# Altium schematic sheet 2-CPU_POWER.SchDoc
size C
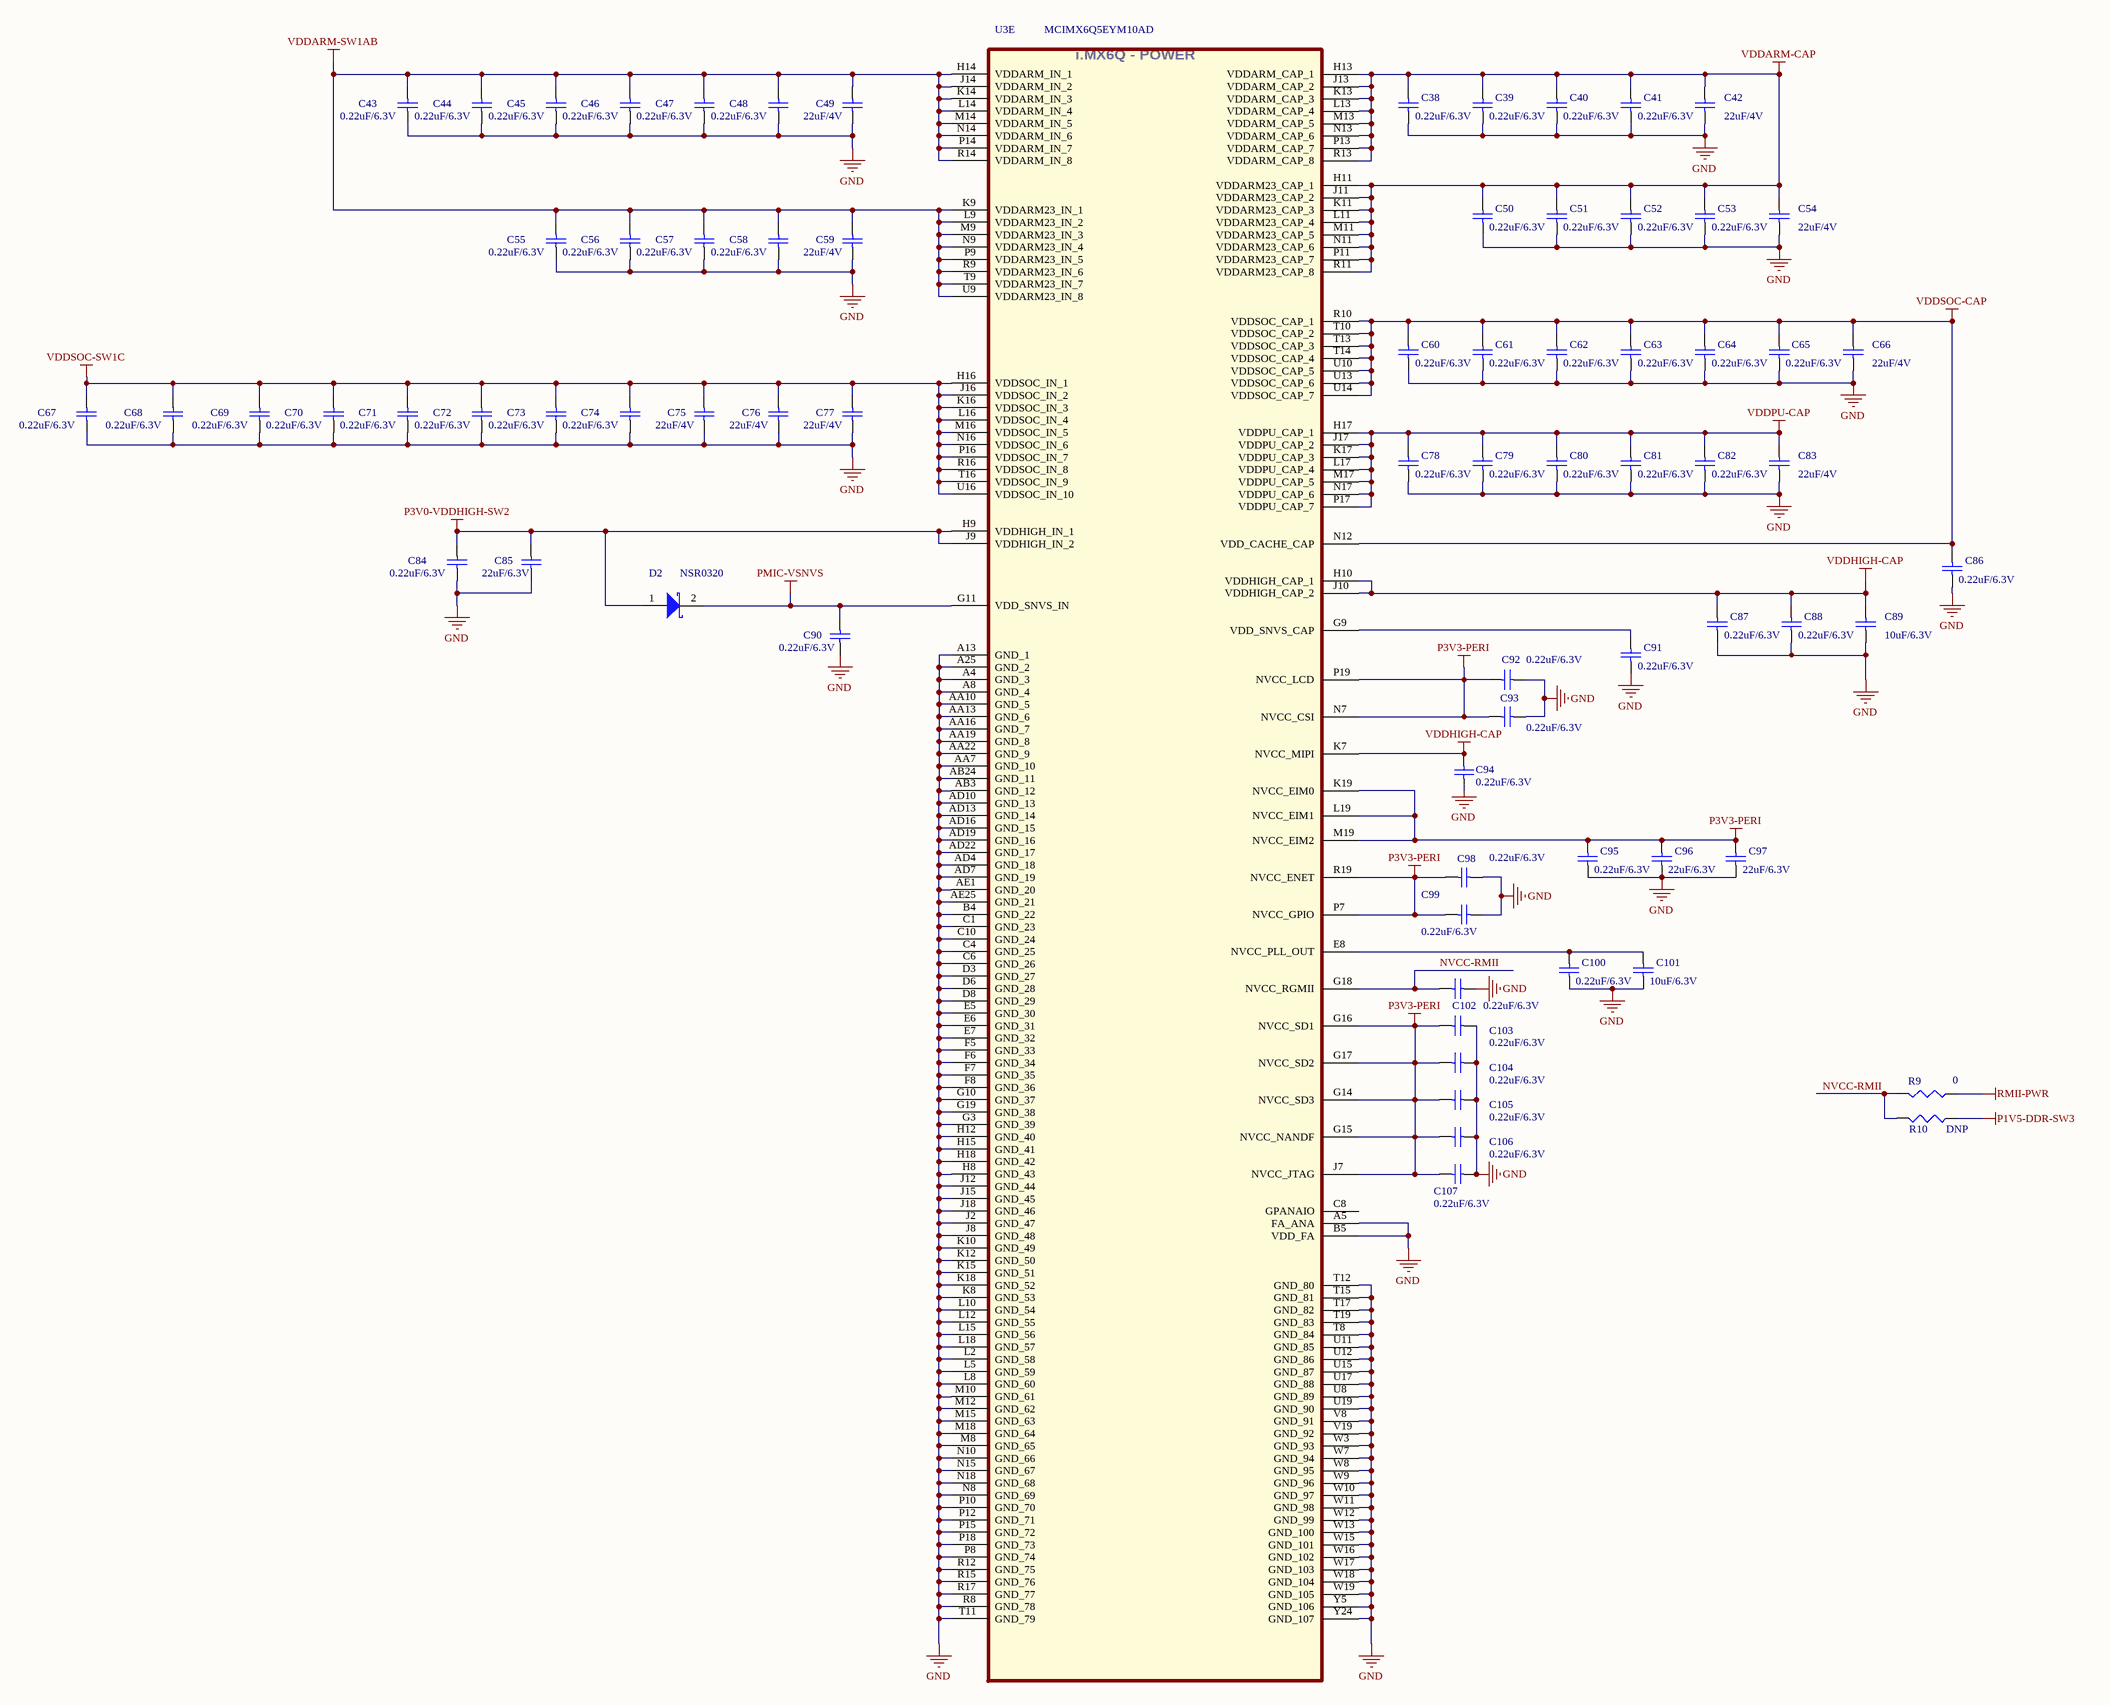
[diagram p0: 2-CPU_POWER.SchDoc]

## Parts
C38  0.22uF/6.3V  [0201_CC]
C39  0.22uF/6.3V  [0201_CC]
C40  0.22uF/6.3V  [0201_CC]
C41  0.22uF/6.3V  [0201_CC]
C42  22uF/4V  [0603_CC]
C43  0.22uF/6.3V  [0201_CC]
C44  0.22uF/6.3V  [0201_CC]
C45  0.22uF/6.3V  [0201_CC]
C46  0.22uF/6.3V  [0201_CC]
C47  0.22uF/6.3V  [0201_CC]
C48  0.22uF/6.3V  [0201_CC]
C49  22uF/4V  [0603_CC]
C50  0.22uF/6.3V  [0201_CC]
C51  0.22uF/6.3V  [0201_CC]
C52  0.22uF/6.3V  [0201_CC]
C53  0.22uF/6.3V  [0201_CC]
C54  22uF/4V  [0603_CC]
C55  0.22uF/6.3V  [0201_CC]
C56  0.22uF/6.3V  [0201_CC]
C57  0.22uF/6.3V  [0201_CC]
C58  0.22uF/6.3V  [0201_CC]
C59  22uF/4V  [0603_CC]
C60  0.22uF/6.3V  [0201_CC]
C61  0.22uF/6.3V  [0201_CC]
C62  0.22uF/6.3V  [0201_CC]
C63  0.22uF/6.3V  [0201_CC]
C64  0.22uF/6.3V  [0201_CC]
C65  0.22uF/6.3V  [0201_CC]
C66  22uF/4V  [0603_CC]
C67  0.22uF/6.3V  [0201_CC]
C68  0.22uF/6.3V  [0201_CC]
C69  0.22uF/6.3V  [0201_CC]
C70  0.22uF/6.3V  [0201_CC]
C71  0.22uF/6.3V  [0201_CC]
C72  0.22uF/6.3V  [0201_CC]
C73  0.22uF/6.3V  [0201_CC]
C74  0.22uF/6.3V  [0201_CC]
C75  22uF/4V  [0603_CC]
C76  22uF/4V  [0603_CC]
C77  22uF/4V  [0603_CC]
C78  0.22uF/6.3V  [0201_CC]
C79  0.22uF/6.3V  [0201_CC]
C80  0.22uF/6.3V  [0201_CC]
C81  0.22uF/6.3V  [0201_CC]
C82  0.22uF/6.3V  [0201_CC]
C83  22uF/4V  [0603_CC]
C84  0.22uF/6.3V  [0201_CC]
C85  22uF/6.3V  [0805_CC]
C86  0.22uF/6.3V  [0201_CC]
C87  0.22uF/6.3V  [0201_CC]
C88  0.22uF/6.3V  [0201_CC]
C89  10uF/6.3V  [0805_CC]
C90  0.22uF/6.3V  [0201_CC]
C91  0.22uF/6.3V  [0201_CC]
C92  0.22uF/6.3V  [0201_CC]
C93  0.22uF/6.3V  [0201_CC]
C94  0.22uF/6.3V  [0201_CC]
C95  0.22uF/6.3V  [0201_CC]
C96  22uF/6.3V  [0805_CC]
C97  22uF/6.3V  [0805_CC]
C98  0.22uF/6.3V  [0201_CC]
C99  0.22uF/6.3V  [0201_CC]
C100  0.22uF/6.3V  [0201_CC]
C101  10uF/6.3V  [0805_CC]
C102  0.22uF/6.3V  [0201_CC]
C103  0.22uF/6.3V  [0201_CC]
C104  0.22uF/6.3V  [0201_CC]
C105  0.22uF/6.3V  [0201_CC]
C106  0.22uF/6.3V  [0201_CC]
C107  0.22uF/6.3V  [0201_CC]
D2  NSR0320  [SOD323]
R9  0  [0603_CC]
R10  DNP  [0603_CC]
U3  MCIMX6Q5EYM10AD  [FCPBGA]  (part E of 12)

## Nets
GND: C38.2 C39.2 C40.2 C41.2 C42.2 C43.2 C44.2 C45.2 C46.2 C47.2 C48.2 C49.2 C50.2 C51.2 C52.2 C53.2 C54.2 C55.2 C56.2 C57.2 C58.2 C59.2 C60.2 C61.2 C62.2 C63.2 C64.2 C65.2 C66.2 C67.2 C68.2 C69.2 C70.2 C71.2 C72.2 C73.2 C74.2 C75.2 C76.2 C77.2 C78.2 C79.2 C80.2 C81.2 C82.2 C83.2 C84.2 C85.2 C86.2 C87.2 C88.2 C89.2 C90.2 C91.2 C92.2 C93.2 C94.1 C95.2 C96.2 C97.2 C98.2 C99.2 C100.2 C101.2 C102.2 C103.2 C104.2 C105.2 C106.2 C107.2 U3.A4(GND_3) U3.A5(FA_ANA) U3.A8(GND_4) U3.A13(GND_1) U3.A25(GND_2) U3.AA7(GND_10) U3.AA10(GND_5) U3.AA13(GND_6) U3.AA16(GND_7) U3.AA19(GND_8) U3.AA22(GND_9) U3.AB3(GND_12) U3.AB24(GND_11) U3.AD4(GND_18) U3.AD7(GND_19) U3.AD10(GND_13) U3.AD13(GND_14) U3.AD16(GND_15) U3.AD19(GND_16) U3.AD22(GND_17) U3.AE1(GND_20) U3.AE25(GND_21) U3.B4(GND_22) U3.B5(VDD_FA) U3.C1(GND_23) U3.C4(GND_25) U3.C6(GND_26) U3.C10(GND_24) U3.D3(GND_27) U3.D6(GND_28) U3.D8(GND_29) U3.E5(GND_30) U3.E6(GND_31) U3.E7(GND_32) U3.F5(GND_33) U3.F6(GND_34) U3.F7(GND_35) U3.F8(GND_36) U3.G3(GND_39) U3.G10(GND_37) U3.G19(GND_38) U3.H8(GND_43) U3.H12(GND_40) U3.H15(GND_41) U3.H18(GND_42) U3.J2(GND_47) U3.J8(GND_48) U3.J12(GND_44) U3.J15(GND_45) U3.J18(GND_46) U3.K8(GND_53) U3.K10(GND_49) U3.K12(GND_50) U3.K15(GND_51) U3.K18(GND_52) U3.L2(GND_58) U3.L5(GND_59) U3.L8(GND_60) U3.L10(GND_54) U3.L12(GND_55) U3.L15(GND_56) U3.L18(GND_57) U3.M8(GND_65) U3.M10(GND_61) U3.M12(GND_62) U3.M15(GND_63) U3.M18(GND_64) U3.N8(GND_69) U3.N10(GND_66) U3.N15(GND_67) U3.N18(GND_68) U3.P8(GND_74) U3.P10(GND_70) U3.P12(GND_71) U3.P15(GND_72) U3.P18(GND_73) U3.R8(GND_78) U3.R12(GND_75) U3.R15(GND_76) U3.R17(GND_77) U3.T8(GND_84) U3.T11(GND_79) U3.T12(GND_80) U3.T15(GND_81) U3.T17(GND_82) U3.T19(GND_83) U3.U8(GND_89) U3.U11(GND_85) U3.U12(GND_86) U3.U15(GND_87) U3.U17(GND_88) U3.U19(GND_90) U3.V8(GND_91) U3.V19(GND_92) U3.W3(GND_93) U3.W7(GND_94) U3.W8(GND_95) U3.W9(GND_96) U3.W10(GND_97) U3.W11(GND_98) U3.W12(GND_99) U3.W13(GND_100) U3.W15(GND_101) U3.W16(GND_102) U3.W17(GND_103) U3.W18(GND_104) U3.W19(GND_105) U3.Y5(GND_106) U3.Y24(GND_107)
P1V5-DDR-SW3: R10.1
P3V0-VDDHIGH-SW2: C84.1 C85.1 D2.1(A) U3.H9(VDDHIGH_IN_1) U3.J9(VDDHIGH_IN_2)
P3V3-PERI: C92.1 C93.1 C95.1 C96.1 C97.1 C98.1 C99.1 C103.1 C104.1 C105.1 C106.1 C107.1 U3.G14(NVCC_SD3) U3.G15(NVCC_NANDF) U3.G16(NVCC_SD1) U3.G17(NVCC_SD2) U3.J7(NVCC_JTAG) U3.K19(NVCC_EIM0) U3.L19(NVCC_EIM1) U3.M19(NVCC_EIM2) U3.N7(NVCC_CSI) U3.P7(NVCC_GPIO) U3.P19(NVCC_LCD) U3.R19(NVCC_ENET)
PMIC-VSNVS: C90.1 D2.2(K) U3.G11(VDD_SNVS_IN)
RMII-PWR: R9.1
VDDARM-CAP: C38.1 C39.1 C40.1 C41.1 C42.1 C50.1 C51.1 C52.1 C53.1 C54.1 U3.H11(VDDARM23_CAP_1) U3.H13(VDDARM_CAP_1) U3.J11(VDDARM23_CAP_2) U3.J13(VDDARM_CAP_2) U3.K11(VDDARM23_CAP_3) U3.K13(VDDARM_CAP_3) U3.L11(VDDARM23_CAP_4) U3.L13(VDDARM_CAP_4) U3.M11(VDDARM23_CAP_5) U3.M13(VDDARM_CAP_5) U3.N11(VDDARM23_CAP_6) U3.N13(VDDARM_CAP_6) U3.P11(VDDARM23_CAP_7) U3.P13(VDDARM_CAP_7) U3.R11(VDDARM23_CAP_8) U3.R13(VDDARM_CAP_8)
VDDARM-SW1AB: C43.1 C44.1 C45.1 C46.1 C47.1 C48.1 C49.1 C55.1 C56.1 C57.1 C58.1 C59.1 U3.H14(VDDARM_IN_1) U3.J14(VDDARM_IN_2) U3.K9(VDDARM23_IN_1) U3.K14(VDDARM_IN_3) U3.L9(VDDARM23_IN_2) U3.L14(VDDARM_IN_4) U3.M9(VDDARM23_IN_3) U3.M14(VDDARM_IN_5) U3.N9(VDDARM23_IN_4) U3.N14(VDDARM_IN_6) U3.P9(VDDARM23_IN_5) U3.P14(VDDARM_IN_7) U3.R9(VDDARM23_IN_6) U3.R14(VDDARM_IN_8) U3.T9(VDDARM23_IN_7) U3.U9(VDDARM23_IN_8)
VDDHIGH-CAP: C87.1 C88.1 C89.1 C94.2 U3.H10(VDDHIGH_CAP_1) U3.J10(VDDHIGH_CAP_2) U3.K7(NVCC_MIPI)
VDDPU-CAP: C78.1 C79.1 C80.1 C81.1 C82.1 C83.1 U3.H17(VDDPU_CAP_1) U3.J17(VDDPU_CAP_2) U3.K17(VDDPU_CAP_3) U3.L17(VDDPU_CAP_4) U3.M17(VDDPU_CAP_5) U3.N17(VDDPU_CAP_6) U3.P17(VDDPU_CAP_7)
VDDSOC-CAP: C60.1 C61.1 C62.1 C63.1 C64.1 C65.1 C66.1 C86.1 U3.N12(VDD_CACHE_CAP) U3.R10(VDDSOC_CAP_1) U3.T10(VDDSOC_CAP_2) U3.T13(VDDSOC_CAP_3) U3.T14(VDDSOC_CAP_4) U3.U10(VDDSOC_CAP_5) U3.U13(VDDSOC_CAP_6) U3.U14(VDDSOC_CAP_7)
VDDSOC-SW1C: C67.1 C68.1 C69.1 C70.1 C71.1 C72.1 C73.1 C74.1 C75.1 C76.1 C77.1 U3.H16(VDDSOC_IN_1) U3.J16(VDDSOC_IN_2) U3.K16(VDDSOC_IN_3) U3.L16(VDDSOC_IN_4) U3.M16(VDDSOC_IN_5) U3.N16(VDDSOC_IN_6) U3.P16(VDDSOC_IN_7) U3.R16(VDDSOC_IN_8) U3.T16(VDDSOC_IN_9) U3.U16(VDDSOC_IN_10)
NVCC-RMII: C102.1 R9.2 R10.2 U3.G18(NVCC_RGMII)
NetC91_1: C91.1 U3.G9(VDD_SNVS_CAP)
NetC100_1: C100.1 C101.1 U3.E8(NVCC_PLL_OUT)

Not connected (* = marked no-connect by the designer): U3 C8(GPANAIO)

## Notes on the sheet
- (in symbol PCIMX6Q6VV1A, part E) i.MX6Q - POWER

## Library data of the parts
C38-C107 = Cap: Capacitor; Published: 8-Jun-2000; LatestRevisionDate: 17-Jul-2002; LatestRevisionNote: Re-released for DXP Platform.; PackageReference: RAD-0.3; Publisher: Altium Limited; PackageDescription: Radial Cap, Thru-Hole; 2 Leads; 0.3 in Pin Spacing
D2 = Diode 11DQ03: Schottky Rectifier
R9 R10 = Res3: Resistor; Published: 8-Jun-2000; LatestRevisionDate: 29-May-2009; LatestRevisionNote: IPC-7351 Footprint Added.; PackageReference: J1-0603; Publisher: Altium Limited; PackageDescription: Chip Resistor
U3 = PCIMX6Q6VV1A: IC MCU MX6QUAD ARM CORTEX-A9 FCPBGA624; AGILE_PN: 344-01218; MFG_NAME01: FREESCALE SEMICONDUCTOR; MFG_PN01: MCIMX6Q6AVT10AC; CAD_APPROVED: Yes; CLASS: IC; ROHS: Yes; HEIGHT: 2.16MM